# Altium schematic sheet FPGA-3.SchDoc
size A3; Date: Date; CompanyName: HESSO; Engineer: Name; Address1: Route du Rawyl 47; Address2: 1950 Sion; Address3: Switzerland; ProjectName: Project Name
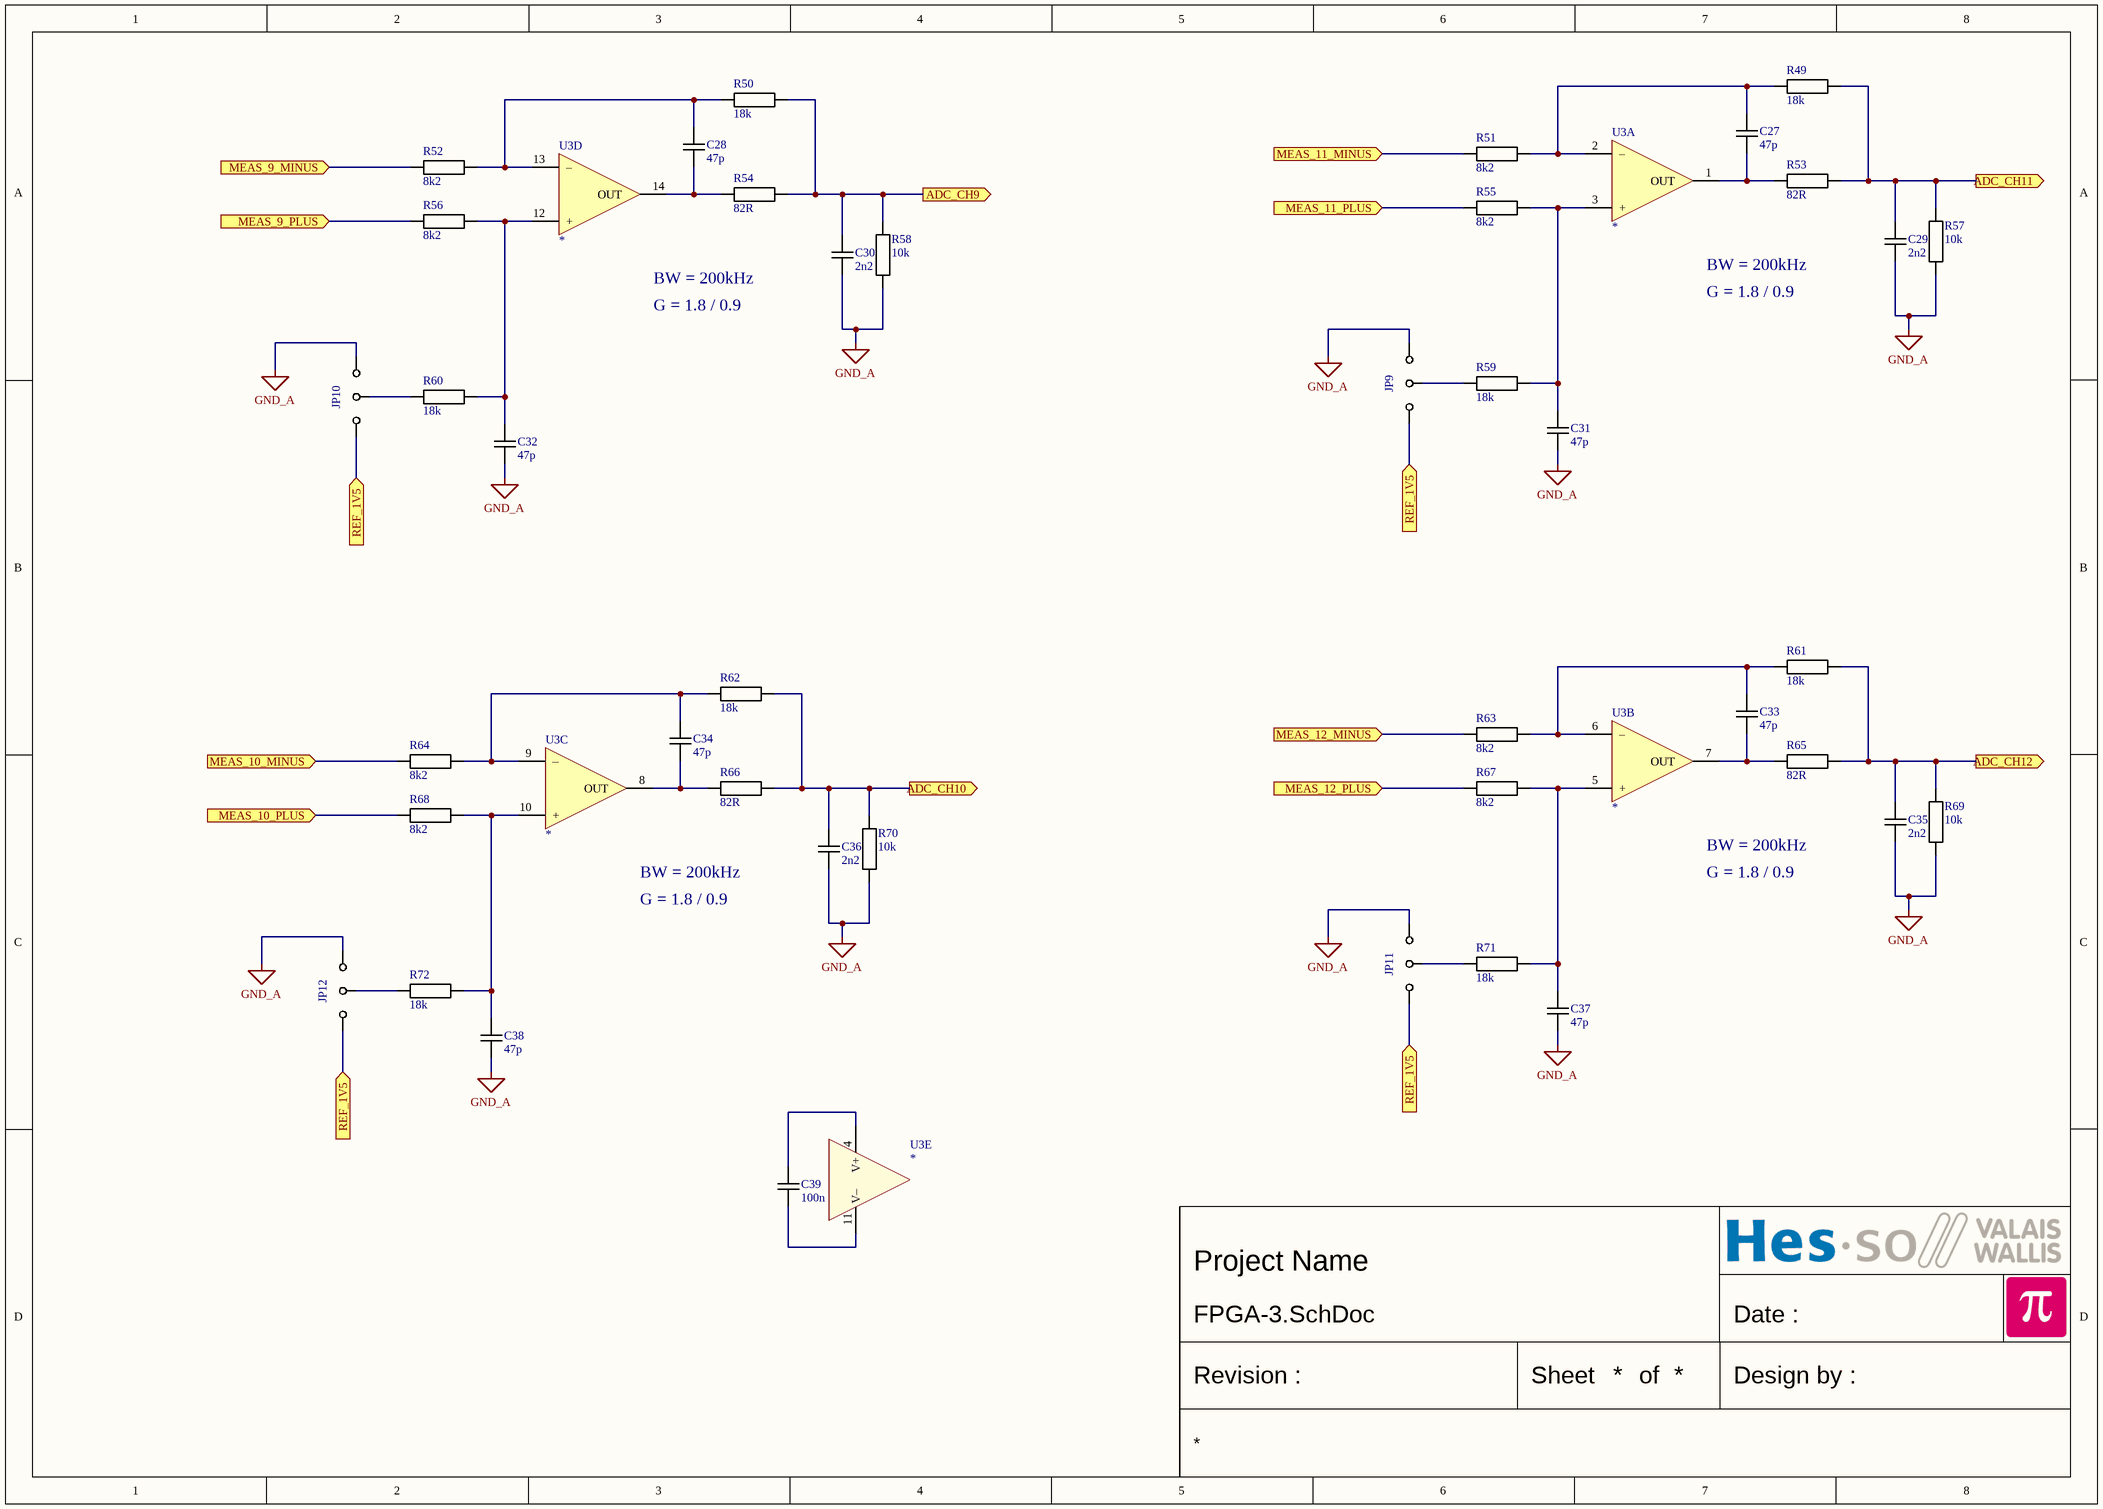
[diagram p0: FPGA-3.SchDoc]

## Parts
C27  47p  [CAPACITOR 1608 REFLOW]
C28  47p  [CAPACITOR 1608 REFLOW]
C29  2n2  [CAPACITOR 1608 REFLOW]
C30  2n2  [CAPACITOR 1608 REFLOW]
C31  47p  [CAPACITOR 1608 REFLOW]
C32  47p  [CAPACITOR 1608 REFLOW]
C33  47p  [CAPACITOR 1608 REFLOW]
C34  47p  [CAPACITOR 1608 REFLOW]
C35  2n2  [CAPACITOR 1608 REFLOW]
C36  2n2  [CAPACITOR 1608 REFLOW]
C37  47p  [CAPACITOR 1608 REFLOW]
C38  47p  [CAPACITOR 1608 REFLOW]
C39  100n  [CAPACITOR 1608 REFLOW]
JP9  {Value}  [JUMPER3 SMD 1608]  (value not drawn)
JP10  {Value}  [JUMPER3 SMD 1608]  (value not drawn)
JP11  {Value}  [JUMPER3 SMD 1608]  (value not drawn)
JP12  {Value}  [JUMPER3 SMD 1608]  (value not drawn)
R49  18k  [RESISTOR 1608 REFLOW]
R50  18k  [RESISTOR 1608 REFLOW]
R51  8k2  [RESISTOR 1608 REFLOW]
R52  8k2  [RESISTOR 1608 REFLOW]
R53  82R  [RESISTOR 1608 REFLOW]
R54  82R  [RESISTOR 1608 REFLOW]
R55  8k2  [RESISTOR 1608 REFLOW]
R56  8k2  [RESISTOR 1608 REFLOW]
R57  10k  [RESISTOR 1608 REFLOW]
R58  10k  [RESISTOR 1608 REFLOW]
R59  18k  [RESISTOR 1608 REFLOW]
R60  18k  [RESISTOR 1608 REFLOW]
R61  18k  [RESISTOR 1608 REFLOW]
R62  18k  [RESISTOR 1608 REFLOW]
R63  8k2  [RESISTOR 1608 REFLOW]
R64  8k2  [RESISTOR 1608 REFLOW]
R65  82R  [RESISTOR 1608 REFLOW]
R66  82R  [RESISTOR 1608 REFLOW]
R67  8k2  [RESISTOR 1608 REFLOW]
R68  8k2  [RESISTOR 1608 REFLOW]
R69  10k  [RESISTOR 1608 REFLOW]
R70  10k  [RESISTOR 1608 REFLOW]
R71  18k  [RESISTOR 1608 REFLOW]
R72  18k  [RESISTOR 1608 REFLOW]
U3  *  [SO14 P1.27 C4.0X8.8 H1.75]  (parts A,B,C,D,E of 5)

## Ports
ADC_CH9 (out), ADC_CH10 (out), ADC_CH11 (out), ADC_CH12 (out), MEAS_9_MINUS (in), MEAS_9_PLUS (in), MEAS_10_MINUS (in), MEAS_10_PLUS (in), MEAS_11_MINUS (in), MEAS_11_PLUS (in), MEAS_12_MINUS (in), MEAS_12_PLUS (in), REF_1V5 (in)

## Nets
GND_A: C29.1 C30.1 C31.1 C32.1 C35.1 C36.1 C37.1 C38.1 JP9.3 JP10.3 JP11.3 JP12.3 R57.2 R58.2 R69.2 R70.2
ADC_CH9: C30.2 R50.2 R54.2 R58.1 ; port ADC_CH9
ADC_CH10: C36.2 R62.2 R66.2 R70.1 ; port ADC_CH10
ADC_CH11: C29.2 R49.2 R53.2 R57.1 ; port ADC_CH11
ADC_CH12: C35.2 R61.2 R65.2 R69.1 ; port ADC_CH12
MEAS_9_MINUS: R52.1 ; port MEAS_9_MINUS
MEAS_9_PLUS: R56.1 ; port MEAS_9_PLUS
MEAS_10_MINUS: R64.1 ; port MEAS_10_MINUS
MEAS_10_PLUS: R68.1 ; port MEAS_10_PLUS
MEAS_11_MINUS: R51.1 ; port MEAS_11_MINUS
MEAS_11_PLUS: R55.1 ; port MEAS_11_PLUS
MEAS_12_MINUS: R63.1 ; port MEAS_12_MINUS
MEAS_12_PLUS: R67.1 ; port MEAS_12_PLUS
REF_1V5: JP9.1 JP10.1 JP11.1 JP12.1 ; port REF_1V5
NetC27_1: C27.1 R53.1 U3.1(OUT)
NetC27_2: C27.2 R49.1 R51.2 U3.2(–)
NetC28_1: C28.1 R54.1 U3.14(OUT)
NetC28_2: C28.2 R50.1 R52.2 U3.13(–)
NetC31_2: C31.2 R55.2 R59.1 U3.3(+)
NetC32_2: C32.2 R56.2 R60.1 U3.12(+)
NetC33_1: C33.1 R65.1 U3.7(OUT)
NetC33_2: C33.2 R61.1 R63.2 U3.6(–)
NetC34_1: C34.1 R66.1 U3.8(OUT)
NetC34_2: C34.2 R62.1 R64.2 U3.9(–)
NetC37_2: C37.2 R67.2 R71.1 U3.5(+)
NetC38_2: C38.2 R68.2 R72.1 U3.10(+)
NetC39_1: C39.1 U3.11(V–)
NetC39_2: C39.2 U3.4(V+)
NetJP9_2: JP9.2 R59.2
NetJP10_2: JP10.2 R60.2
NetJP11_2: JP11.2 R71.2
NetJP12_2: JP12.2 R72.2

## Notes on the sheet
- BW = 200kHz
- G = 1.8 / 0.9
- Date :
- Revision :
- Sheet
- of
- Design by :

## Library data of the parts
C27-C39 = Capacitor: Capacitor X7R 10% 50V 1608(0603)
  C27 C28 C31-C34 C37 C38: Value: 47p
  C29 C30 C35 C36: Value: 2n2
  C39: Value: 100n
JP9-JP12 = JUMPER 3 POS: Value: {Value}
R49-R72 = Resistor: Resistor 1% 50V 100mW 1608(0603)
  R49 R50 R59-R62 R71 R72: Value: 18k
  R51 R52 R55 R56 R63 R64 R67 R68: Value: 8k2
  R53 R54 R65 R66: Value: 82R
  R57 R58 R69 R70: Value: 10k
U3 = OPA QUAD: Generic quad OPA 14 pins; Value: *